# EAGLE design G021 (EAGLE 6.6.0)
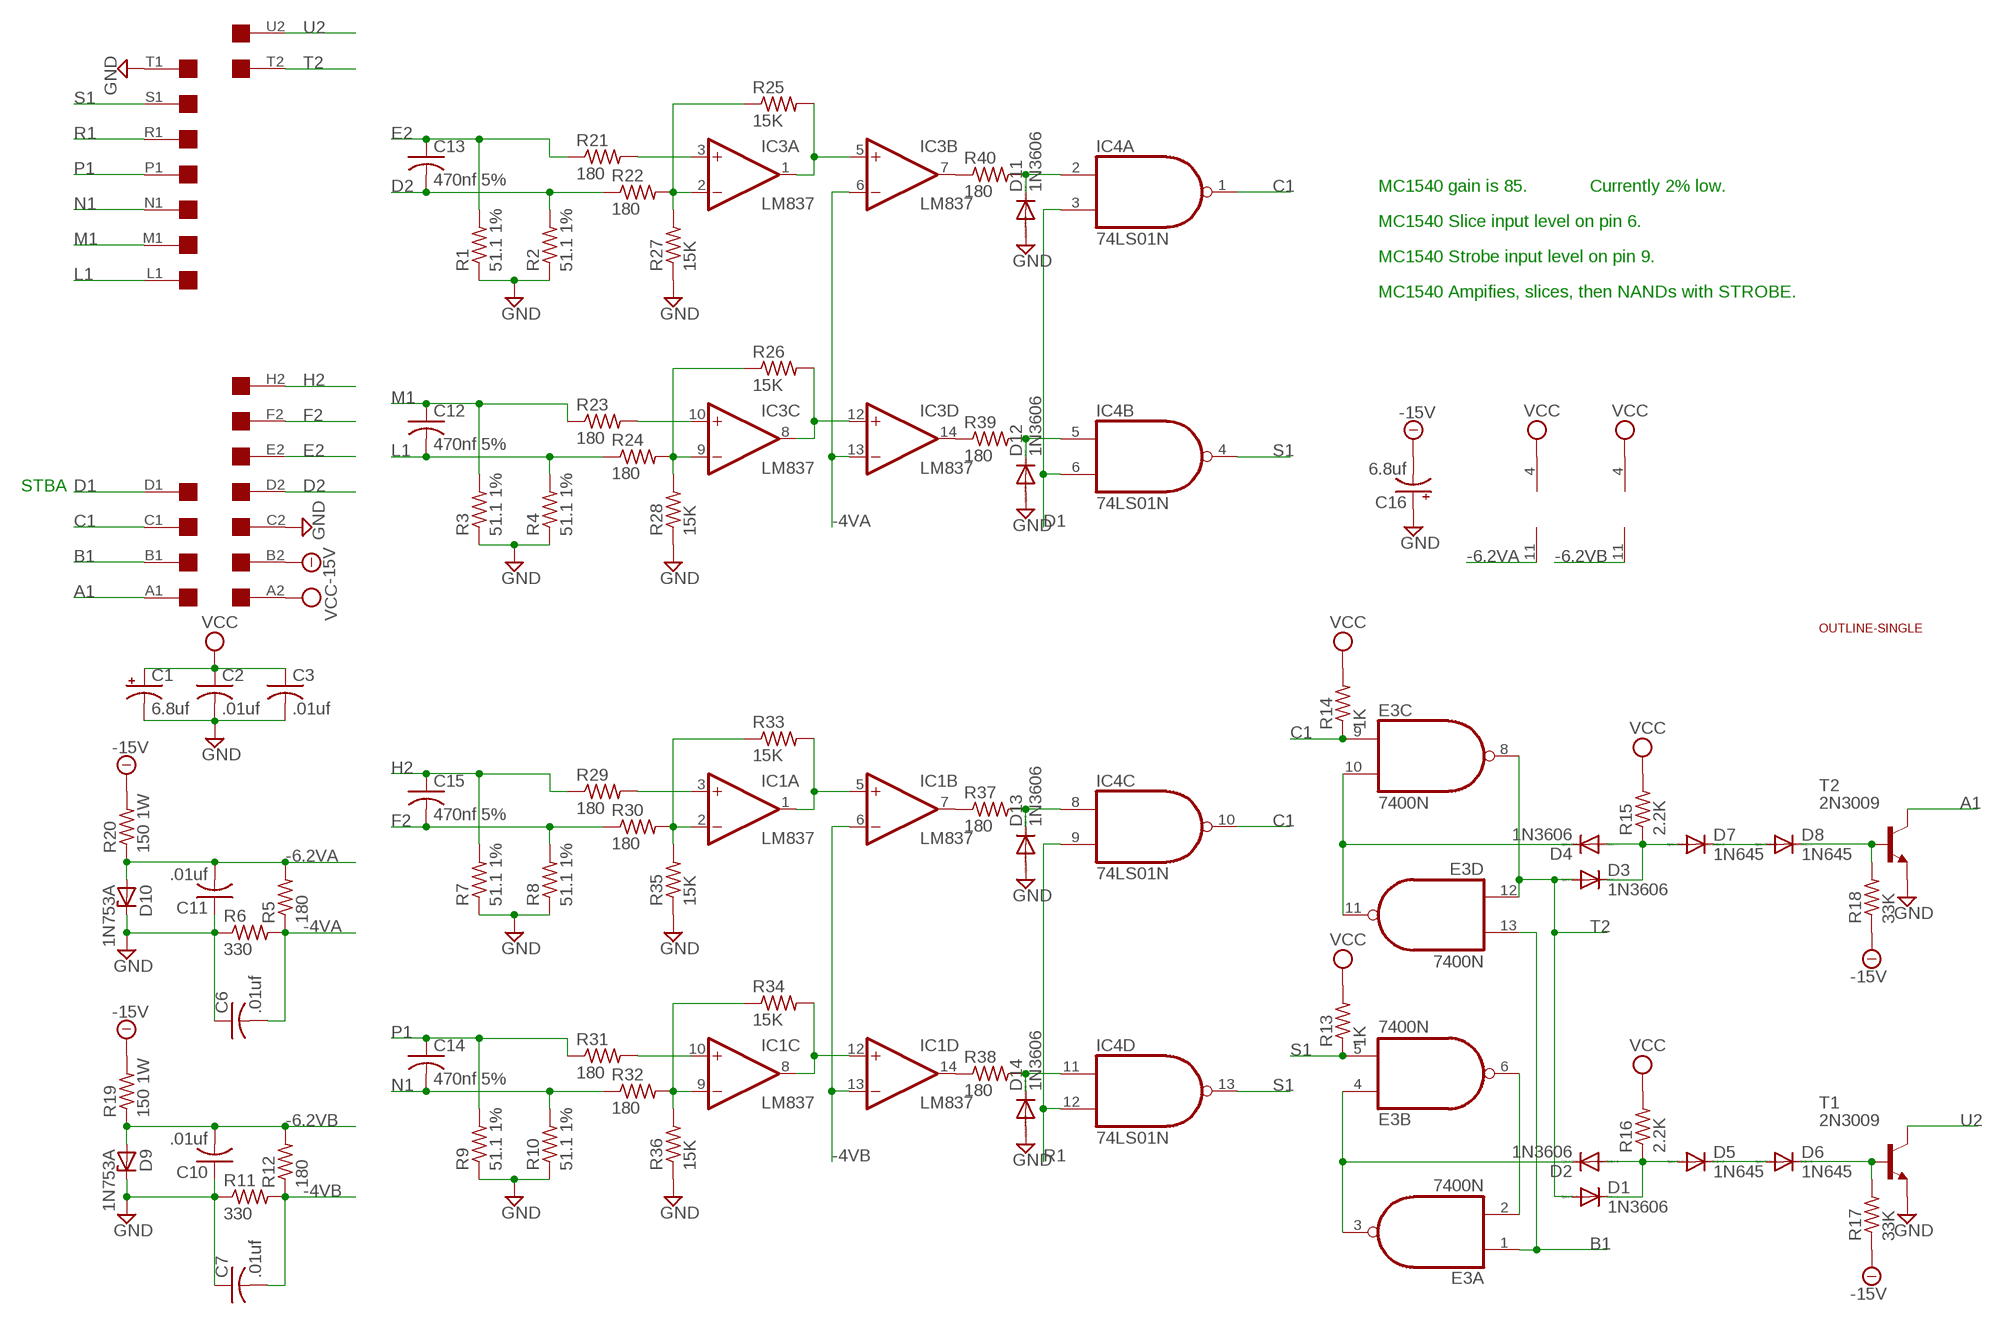
[diagram p0: schematic, sheet 1]

## Parts
C1  6.8uf  CPOL-USE15-5AXIAL  [E15-5]
C2  .01uf  C-US050-025X075  [C050-025X075]
C3  .01uf  C-US050-025X075  [C050-025X075]
C6  .01uf  C-US050-025X075  [C050-025X075]
C7  .01uf  C-US050-025X075  [C050-025X075]
C10  .01uf  C-US050-025X075  [C050-025X075]
C11  .01uf  C-US050-025X075  [C050-025X075]
C12  470nf 5%  C-US050-025X075  [C050-025X075]
C13  470nf 5%  C-US050-025X075  [C050-025X075]
C14  470nf 5%  C-US050-025X075  [C050-025X075]
C15  470nf 5%  C-US050-025X075  [C050-025X075]
C16  6.8uf  CPOL-USE15-5AXIAL  [E15-5]
D1  1N3606  1N4148DO35-10  [DO35-10]
D2  1N3606  1N4148DO35-10  [DO35-10]
D3  1N3606  1N4148DO35-10  [DO35-10]
D4  1N3606  1N4148DO35-10  [DO35-10]
D5  1N645  1N4148DO35-10  [DO35-10]
D6  1N645  1N4148DO35-10  [DO35-10]
D7  1N645  1N4148DO35-10  [DO35-10]
D8  1N645  1N4148DO35-10  [DO35-10]
D9  1N753A  ZENER-DIODEF126-10  [F126Z10]
D10  1N753A  ZENER-DIODEF126-10  [F126Z10]
D11  1N3606  1N4148DO35-10  [DO35-10]
D12  1N3606  1N4148DO35-10  [DO35-10]
D13  1N3606  1N4148DO35-10  [DO35-10]
D14  1N3606  1N4148DO35-10  [DO35-10]
E3  7400N  [DIL14]
IC1  LM837  OP11P  [DIL14]
IC3  LM837  OP11P  [DIL14]
IC4  74LS01N  [DIL14]
R1  51.1 1%  R-US_0207/10  [0207/10]
R2  51.1 1%  R-US_0207/10  [0207/10]
R3  51.1 1%  R-US_0207/10  [0207/10]
R4  51.1 1%  R-US_0207/10  [0207/10]
R5  180  R-US_0207/10  [0207/10]
R6  330  R-US_0207/10  [0207/10]
R7  51.1 1%  R-US_0207/10  [0207/10]
R8  51.1 1%  R-US_0207/10  [0207/10]
R9  51.1 1%  R-US_0207/10  [0207/10]
R10  51.1 1%  R-US_0207/10  [0207/10]
R11  330  R-US_0207/10  [0207/10]
R12  180  R-US_0207/10  [0207/10]
R13  1K  R-US_0207/10  [0207/10]
R14  1K  R-US_0207/10  [0207/10]
R15  2.2K  R-US_0207/10  [0207/10]
R16  2.2K  R-US_0207/10  [0207/10]
R17  33K  R-US_0207/10  [0207/10]
R18  33K  R-US_0207/10  [0207/10]
R19  150 1W  R-US_0414/15  [0414/15]
R20  150 1W  R-US_0414/15  [0414/15]
R21  180  R-US_0207/10  [0207/10]
R22  180  R-US_0207/10  [0207/10]
R23  180  R-US_0207/10  [0207/10]
R24  180  R-US_0207/10  [0207/10]
R25  15K  R-US_0207/10  [0207/10]
R26  15K  R-US_0207/10  [0207/10]
R27  15K  R-US_0207/10  [0207/10]
R28  15K  R-US_0207/10  [0207/10]
R29  180  R-US_0207/10  [0207/10]
R30  180  R-US_0207/10  [0207/10]
R31  180  R-US_0207/10  [0207/10]
R32  180  R-US_0207/10  [0207/10]
R33  15K  R-US_0207/10  [0207/10]
R34  15K  R-US_0207/10  [0207/10]
R35  15K  R-US_0207/10  [0207/10]
R36  15K  R-US_0207/10  [0207/10]
R37  180  R-US_0207/10  [0207/10]
R38  180  R-US_0207/10  [0207/10]
R39  180  R-US_0207/10  [0207/10]
R40  180  R-US_0207/10  [0207/10]
T1  2N3009  2N3565  [TO92]
T2  2N3009  2N3565  [TO92]
U$1  SINGLE  [EDGE-CON2]
U$2  OUTLINE-SINGLE  [SINGLE]

## Nets
-4VA: C6.2 IC3.6(B:-IN) IC3.13(D:-IN) R5.1 R6.2
-4VB: C7.2 IC1.6(B:-IN) IC1.13(D:-IN) R11.2 R12.1
-6.2VA: C11.2 D10.A IC3.11(P:V-) R5.2 R20.1
-6.2VB: C10.2 D9.A IC1.11(P:V-) R12.2 R19.1
-15V: C16.- R17.1 R18.1 R19.2 R20.2 U$1.B2
A1: T2.1(C) U$1.A1
B1: E3.1(A:I0) E3.13(D:I1) U$1.B1
C1: E3.9(C:I0) IC4.1(A:O) IC4.10(C:O) R14.1 U$1.C1
D1: IC4.3(A:I1) IC4.6(B:I1) U$1.D1
D2: C13.2 R2.2 R22.1 U$1.D2
E2: C13.1 R1.2 R21.1 U$1.E2
F2: C15.2 R8.2 R30.1 U$1.F2
GND [supply]: C1.- C2.2 C3.2 C6.1 C7.1 C10.1 C11.1 C16.+ D9.C D10.C D11.A D12.A D13.A D14.A R1.1 R2.1 R3.1 R4.1 R6.1 R7.1 R8.1 R9.1 R10.1 R11.1 R27.1 R28.1 R35.1 R36.1 T1.3(E) T2.3(E) U$1.C2 U$1.T1
H2: C15.1 R7.2 R29.1 U$1.H2
L1: C12.2 R4.2 R24.1 U$1.L1
M1: C12.1 R3.2 R23.1 U$1.M1
N1: C14.2 R10.2 R32.1 U$1.N1
N$1: IC3.7(B:OUT) R40.1
N$2: IC3.14(D:OUT) R39.1
N$3: IC1.7(B:OUT) R37.1
N$4: IC1.14(D:OUT) R38.1
N$5: IC3.8(C:OUT) IC3.12(D:+IN) R26.2
N$6: D1.C D2.A D5.A R16.1
N$7: D4.C E3.10(C:I1) E3.11(D:O)
N$8: D2.C E3.3(A:O) E3.4(B:I0)
N$9: E3.2(A:I1) E3.6(B:O)
N$10: D3.C D4.A D7.A R15.1
N$11: D7.C D8.A
N$12: D5.C D6.A
N$13: D8.C R18.2 T2.2(B)
N$14: D6.C R17.2 T1.2(B)
N$15: IC3.1(A:OUT) IC3.5(B:+IN) R25.2
N$20: IC3.9(C:-IN) R24.2 R26.1 R28.2
N$21: IC3.10(C:+IN) R23.2
N$22: IC3.2(A:-IN) R22.2 R25.1 R27.2
N$23: IC3.3(A:+IN) R21.2
N$24: IC1.8(C:OUT) IC1.12(D:+IN) R34.2
N$25: IC1.1(A:OUT) IC1.5(B:+IN) R33.2
N$30: IC1.9(C:-IN) R32.2 R34.1 R36.2
N$31: IC1.10(C:+IN) R31.2
N$32: IC1.2(A:-IN) R30.2 R33.1 R35.2
N$33: IC1.3(A:+IN) R29.2
N$34: D11.C IC4.2(A:I0) R40.2
N$35: D12.C IC4.5(B:I0) R39.2
N$36: D14.C IC4.11(D:I0) R38.2
N$37: D13.C IC4.8(C:I0) R37.2
P1: C14.1 R9.2 R31.1 U$1.P1
R1: IC4.9(C:I1) IC4.12(D:I1) U$1.R1
S1: E3.5(B:I1) IC4.4(B:O) IC4.13(D:O) R13.1 U$1.S1
T2: D1.A D3.A E3.8(C:O) E3.12(D:I0) U$1.T2
U2: T1.1(C) U$1.U2
VCC [supply]: C1.+ C2.1 C3.1 IC1.4(P:V+) IC3.4(P:V+) R13.2 R14.2 R15.2 R16.2 U$1.A2
Unconnected: U$1.E1 U$1.F1 U$1.H1 U$1.J1 U$1.J2 U$1.K1 U$1.K2 U$1.L2 U$1.M2 U$1.N2 U$1.P2 U$1.R2 U$1.S2 U$1.U1 U$1.V1 U$1.V2

## Notes on the sheet
- MC1540 gain is 85. | Currently 2% low.
- MC1540 Slice input level on pin 6.
- MC1540 Strobe input level on pin 9.
- MC1540 Ampifies, slices, then NANDs with STROBE.
- STBA

## Power pins joined to a net without a drawn wire
GND: E3.7(P:GND) IC4.7(P:GND)
VCC: E3.14(P:VCC) IC4.14(P:VCC)

## Library data of the parts
C1 C16 = rcl:CPOL-US: POLARIZED CAPACITOR, American symbol
C2 C3 C6 C7 C10-C15 = rcl:C-US: CAPACITOR, American symbol
D1-D8 D11-D14 = diode:1N4148: DIODE high speed (Philips)
D9 D10 = diode:ZENER-DIODE: Z-Diode
E3 = 74xx-us:74*00: Quad 2-input NAND gate
IC1 IC3 = linear:OP11: Quad Low-Offset Low-Power OP AMP The OP-11 is pin compatible with the OP-400 , LM148, HA4741, RM4156, and LT1014 operational amplifiers source http://products.analog.com/products/info.asp?product=OP400
IC4 = 74xx-us:74*01: Quad 2-input NAND gate, open collector
R1-R40 = rcl:R-US_: RESISTOR, American symbol
T1 T2 = transistor:2N3565: NPN TRANSISTOR
U$1 = dec-con:SINGLE: Single-Height DEC board
U$2 = dec-con:OUTLINE-*: Board outlines for DEC boards.

## Net classes
1 supply: width 0.762 mm, clearance 0.508 mm

## Board
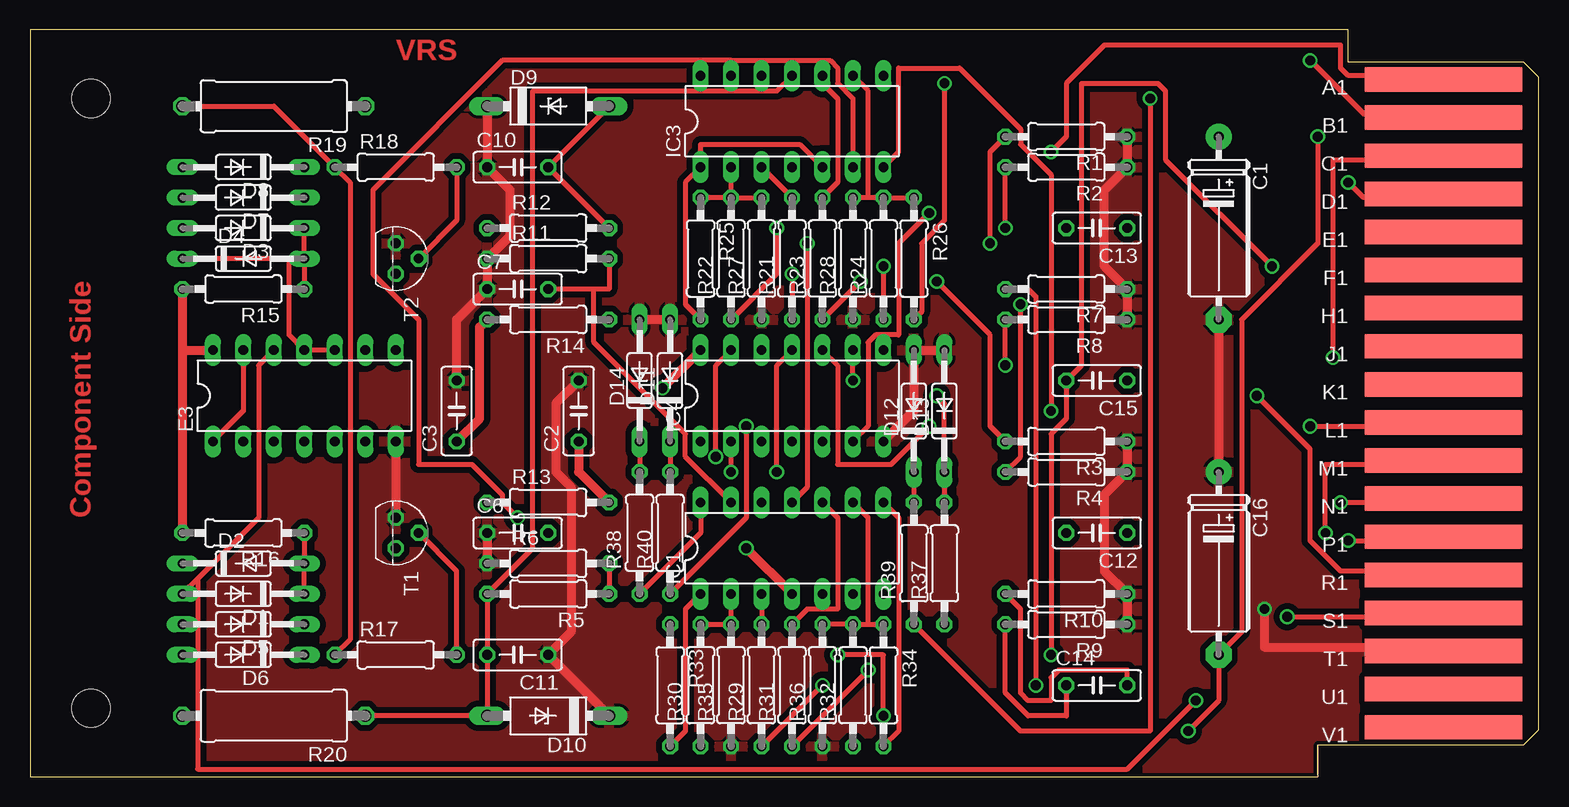
[diagram p1: board, top side]
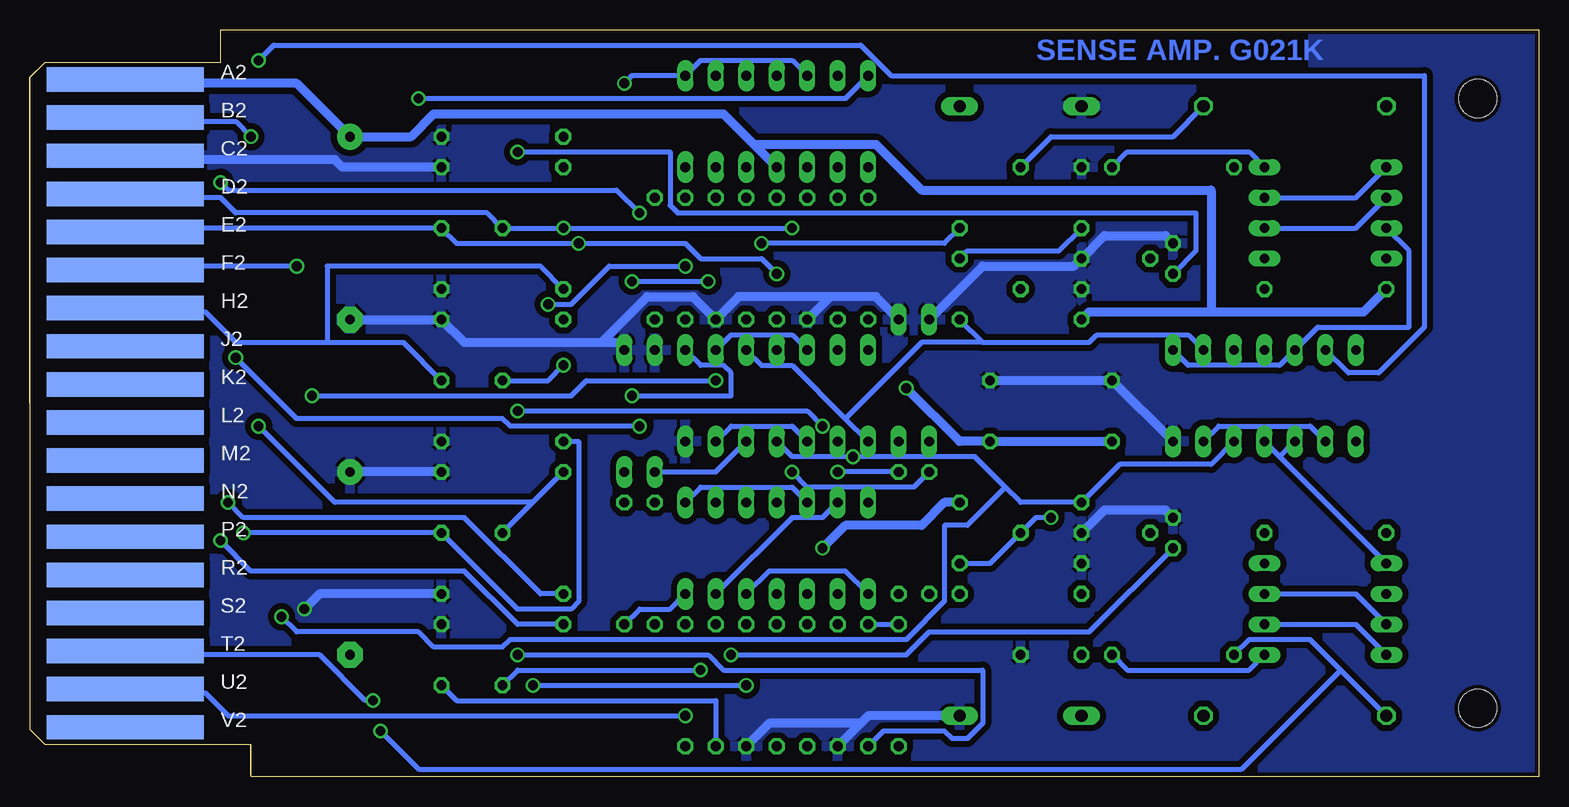
[diagram p2: board, bottom side, seen from below]

Size 125.73 x 62.23 mm. Coordinates in mm from the lower left corner, seen from the top.
Copper layers (1+16): Top 0.035mm / dielectric 1.5mm / Bottom 0.035mm
Design rules "16mils": minimum track width 16mil, minimum drill 32mil, track to track 15mil, track to pad 10mil, pad to pad 10mil, via to via 10mil, smd to smd 10mil, copper to edge 13mil, drill to drill 10mil, minimum pad ring 10mil, minimum via ring 8mil, stop-mask expansion 0mil, vias tented up to drill 0mil, thermal gap 10mil

### Footprints (pad centres in the part's own frame; a part is rotated, then mirrored left to right if it is on the bottom)
E15-5 = drill 0.813 pad 2.159: + -7.62,0 | drill 0.813 pad 2.159 octagon: - 7.62,0
C050-025X075 = drill 0.813 octagon: 1 -2.54,0; 2 2.54,0
DO35-10 = drill 0.813 long: A 5.08,0; C -5.08,0
F126Z10 = drill 1.016 long: A 5.08,0; C -5.08,0
DIL14 = drill 0.813 long: 1 -7.62,-3.81; 2 -5.08,-3.81; 3 -2.54,-3.81; 4 0,-3.81; 5 2.54,-3.81; 6 5.08,-3.81; 7 7.62,-3.81; 8 7.62,3.81; 9 5.08,3.81; 10 2.54,3.81; 11 0,3.81; 12 -2.54,3.81; 13 -5.08,3.81; 14 -7.62,3.81
0207/10 = drill 0.813 octagon: 1 -5.08,0; 2 5.08,0
0414/15 = drill 1.016 octagon: 1 -7.62,0; 2 7.62,0
TO92 = drill 0.813 octagon: 1 1.27,0; 2 0,1.905; 3 -1.27,0
EDGE-CON2 = smd 13.106 x 2.032: A1 7.938,4.128; B1 7.938,7.303; C1 7.938,10.477; D1 7.938,13.652; E1 7.938,16.828; F1 7.938,20.003; H1 7.938,23.177; J1 7.938,26.352; K1 7.938,29.527; L1 7.938,32.703; M1 7.938,35.877; N1 7.938,39.053; P1 7.938,42.227; R1 7.938,45.403; S1 7.938,48.578; T1 7.938,51.752; U1 7.938,54.928; V1 7.938,58.102 | smd 13.106 x 2.032 bottom: A2 7.938,4.128; B2 7.938,7.303; C2 7.938,10.477; D2 7.938,13.652; E2 7.938,16.828; F2 7.938,20.003; H2 7.938,23.177; J2 7.938,26.352; K2 7.938,29.527; L2 7.938,32.703; M2 7.938,35.877; N2 7.938,39.053; P2 7.938,42.227; R2 7.938,45.403; S2 7.938,48.578; T2 7.938,51.752; U2 7.938,54.928; V2 7.938,58.102
SINGLE = hole 3.175: 120.65,56.515; 120.65,5.715

### Placement (x,y rotation side)
C1  99.06,45.72 270 top
C2  45.72,30.48 90 top
C3  35.56,30.48 90 top
C6  40.64,20.32 0 top
C7  40.64,40.64 0 top
C10  40.64,50.8 0 top
C11  40.64,10.16 180 top
C12  88.9,20.32 180 top
C13  88.9,45.72 180 top
C14  88.9,7.62 0 top
C15  88.9,33.02 180 top
C16  99.06,17.78 270 top
D1  17.78,15.24 180 top
D2  17.78,17.78 0 top
D3  17.78,45.72 180 top
D4  17.78,43.18 0 top
D5  17.78,12.7 180 top
D6  17.78,10.16 180 top
D7  17.78,48.26 180 top
D8  17.78,50.8 180 top
D9  43.18,55.88 0 top
D10  43.18,5.08 180 top
D11  53.34,33.02 90 top
D12  73.66,30.48 90 top
D13  76.2,30.48 90 top
D14  50.8,33.02 90 top
E3  22.86,31.75 0 top
IC1  63.5,19.05 0 top
IC3  63.5,54.61 0 top
IC4  63.5,31.75 0 top
R1  86.36,53.34 180 top
R2  86.36,50.8 180 top
R3  86.36,27.94 180 top
R4  86.36,25.4 180 top
R5  43.18,15.24 180 top
R6  43.18,17.78 0 top
R7  86.36,40.64 180 top
R8  86.36,38.1 180 top
R9  86.36,12.7 180 top
R10  86.36,15.24 180 top
R11  43.18,43.18 0 top
R12  43.18,45.72 0 top
R13  43.18,22.86 0 top
R14  43.18,38.1 180 top
R15  17.78,40.64 180 top
R16  17.78,20.32 180 top
R17  30.48,10.16 0 top
R18  30.48,50.8 0 top
R19  20.32,55.88 180 top
R20  20.32,5.08 180 top
R21  63.5,43.18 90 top
R22  58.42,43.18 90 top
R23  66.04,43.18 90 top
R24  71.12,43.18 90 top
R25  55.88,43.18 270 top
R26  73.66,43.18 270 top
R27  60.96,43.18 90 top
R28  68.58,43.18 90 top
R29  60.96,7.62 90 top
R30  55.88,7.62 90 top
R31  63.5,7.62 90 top
R32  68.58,7.62 90 top
R33  53.34,7.62 270 top
R34  71.12,7.62 270 top
R35  58.42,7.62 90 top
R36  66.04,7.62 90 top
R37  76.2,17.78 90 top
R38  50.8,20.32 90 top
R39  73.66,17.78 90 top
R40  53.34,20.32 90 top
T1  30.48,20.32 270 top
T2  30.48,43.18 270 top
U$1  125.73,62.23 180 top
U$2  125.73,62.23 180 top

### Tracks (layer width: path | path; a pad name or v marks a point on that pad's centre or on a via)
-4VA  (via drill 0.81)
  Top 0.406: R6.2 R5.1 | IC3.6 68.58,56.52 67.31,57.78 67.31,59.05 66.67,59.69 58.42,59.69 | IC3.13 58.42,59.69 | v40.64,21.59 39.37,22.86 39.37,23.5 36.83,26.04 32.38,26.04 32.38,38.1 28.57,41.91 28.57,48.9 39.37,59.69 58.42,59.69
  Bottom 0.406: R6.2 45.72,17.78 C6.2 41.91,21.59 v40.64,21.59
-4VB
  Top 0.406: 46.99,40.64 48.26,40.64 R11.2 | 46.99,40.64 C7.2 | 46.99,40.64 46.99,36.2 54.61,28.57 54.61,26.67 IC1.13
  Bottom 0.406: R12.1 40.01,43.81 47.62,43.81 R11.2 | IC1.6 62.23,21.59 59.69,21.59 IC1.13
-6.2VA
  Top 0.406: R20.1 D10.A C11.2 R5.2 41.91,19.05 41.91,57.15 62.23,57.15 IC3.11
-6.2VB  (via drill 0.81)
  Top 0.406: D9.A C10.2 R12.2 | IC1.11 64.77,24.13 v64.77,44.45
  Bottom 0.406: R19.1 30.48,53.34 40.64,53.34 C10.2 | v64.77,44.45 49.53,44.45 R12.2
-15V  (via drill 0.81)
  Top 0.406: R19.2 20.32,55.88 R18.1 26.67,49.53 26.67,11.43 R17.1 | v107.31,53.34 107.31,44.45 100.97,38.1 100.97,12.06 C16.- 99.06,6.35 v96.52,3.81
  Bottom 0.406: R17.1 24.13,11.43 19.05,11.43 16.51,8.89 | R20.2 16.51,8.89 | v107.31,53.34 108.58,54.61 117.47,54.61 U$1.B2 | 16.51,8.89 24.77,0.64 93.34,0.64 v96.52,3.81
A1  (via drill 0.81)
  Top 0.406: v85.09,52.07 86.36,53.34 86.36,57.78 89.53,60.96 109.22,60.96 109.22,59.05 109.86,58.42 117.47,58.42 U$1.A1
  Bottom 0.406: T2.1 28.57,43.81 28.57,46.99 71.75,46.99 72.39,47.62 72.39,52.07 v85.09,52.07
B1  (via drill 0.81)
  Top 0.406: E3.1 17.78,30.48 E3.13 | v106.68,59.69 111.12,55.24 117.47,55.24 U$1.B1
  Bottom 0.406: E3.13 15.88,33.66 13.34,33.66 9.53,37.47 9.53,58.42 53.98,58.42 56.52,60.96 105.41,60.96 v106.68,59.69
C1  (via drill 0.81)
  Top 0.406: v108.58,34.92 108.58,51.44 117.47,51.44 U$1.C1 | v74.93,29.21 71.75,26.04 67.31,26.04 67.31,34.29 IC4.10
  Bottom 0.406: 57.78,29.84 62.23,34.29 64.77,34.29 IC4.10 | 57.78,29.84 IC4.1 | E3.9 29.21,36.83 36.83,36.83 37.47,36.2 46.35,36.2 | R14.1 46.35,36.2 | 57.78,29.84 51.44,36.2 46.35,36.2 | v108.58,34.92 103.5,29.84 86.36,29.84 85.72,29.21 v74.93,29.21
D1  (via drill 0.81)
  Top 0.406: IC4.6 69.85,29.21 69.85,36.2 70.48,36.83 72.39,36.83 72.39,44.45 v74.93,46.99 | v109.86,49.53 111.12,48.26 117.47,48.26 U$1.D1
  Bottom 0.406: IC4.3 62.23,29.21 67.31,29.21 IC4.6 | v74.93,46.99 76.83,48.9 109.22,48.9 v109.86,49.53
D2  (via drill 0.81)
  Top 0.406: R22.1 62.23,41.91 v62.23,45.72 | v81.28,45.72 R2.2
  Bottom 0.406: v62.23,45.72 v81.28,45.72 C13.2 87.63,46.99 108.58,46.99 109.86,48.26 117.47,48.26 U$1.D2
E2  (via drill 0.81)
  Top 0.406: v63.5,41.91 R21.1 | R1.2 80.01,52.07 v80.01,44.45
  Bottom 0.406: v63.5,41.91 64.77,43.18 69.85,43.18 71.12,44.45 v80.01,44.45 90.17,44.45 C13.1 117.47,45.72 U$1.E2
F2  (via drill 0.81)
  Top 0.406: v85.09,10.16 85.09,28.57 86.36,29.84 C15.2 87.63,34.29 87.63,57.78 93.98,57.78 94.61,57.15 94.61,51.44 v103.5,42.55 | v81.28,34.29 R8.2
  Bottom 0.406: R30.1 54.61,3.81 49.53,3.81 48.9,3.17 47.62,3.17 46.35,4.45 46.35,8.89 67.94,8.89 69.22,10.16 v85.09,10.16 | v81.28,34.29 82.55,33.02 C15.2 | v103.5,42.55 117.47,42.55 U$1.F2
GND  (via drill 0.81)
  Top 0.762: D10.C C11.1 45.09,12.06 45.09,24.13 43.81,25.4 43.81,31.11 C2.2 | D9.C C10.1 40.01,48.9 40.01,45.09 R11.1 C7.1 35.56,38.1 C3.2 | C6.1 R6.1 | E3.7 T1.3 | R9.1 R10.1 89.53,17.14 89.53,23.5 R4.1 R3.1 | D11.A D14.A | IC4.7 73.66,30.48 D12.A D13.A | R1.1 R2.1 89.53,48.9 89.53,42.55 R7.1 R8.1 | C1.- C16.+ | v102.87,13.97 102.87,10.79 117.47,10.79 U$1.T1
  Bottom 0.762: 56.52,4.45 55.88,5.08 D10.C | 56.52,4.45 R35.1 | R36.1 64.14,4.45 56.52,4.45 | T2.3 31.11,45.09 36.2,45.09 R11.1 38.73,42.55 46.35,42.55 D14.A | E3.7 C3.2 C2.2 | C6.1 36.2,22.23 31.11,22.23 T1.3 | R4.1 C16.+ | 59.05,40.01 R27.1 | 59.05,40.01 55.24,40.01 D11.A | 59.05,40.01 66.67,40.01 R28.1 70.48,40.01 74.3,40.01 78.11,36.2 | C1.- R8.1 89.53,36.2 78.11,36.2 | D13.A 76.83,36.2 78.11,36.2 | v102.87,13.97 101.6,15.24 R10.1 | R2.1 99.69,50.8 100.33,51.44 117.47,51.44 U$1.C2
  pour Bottom (isolate 0.254): 0,62.23 111.76,62.23 111.76,0 0,0
  pour Top (isolate 0.254): 0,62.23 111.76,62.23 111.76,0 0,0
H2  (via drill 0.81)
  Top 0.406: v66.04,7.62 R29.1 | v83.82,7.62 83.82,40.01 83.19,40.64 R7.2
  Bottom 0.406: C15.1 94.61,36.2 100.97,36.2 | 100.97,36.2 108.58,36.2 111.12,38.73 117.47,38.73 U$1.H2 | v83.82,7.62 v66.04,7.62 | 100.97,36.2 100.97,42.55 83.19,42.55 R7.2
L1  (via drill 0.81)
  Top 0.406: v71.12,42.55 R24.1 | v82.55,39.37 82.55,26.67 R4.2 | v106.68,29.21 117.47,29.21 U$1.L1
  Bottom 0.406: C12.2 83.82,22.86 | 83.82,22.86 R4.2 | v71.12,42.55 77.47,42.55 80.64,39.37 v82.55,39.37 | v106.68,29.21 100.33,22.86 83.82,22.86
M1  (via drill 0.81)
  Top 0.406: v69.22,41.27 R23.1 | v75.56,41.27 80.01,36.83 80.01,29.21 R3.2 | v107.95,20.32 107.95,26.04 117.47,26.04 U$1.M1
  Bottom 0.406: v75.56,41.27 v69.22,41.27 | R3.2 80.01,27.94 80.01,14.61 80.64,13.97 85.09,13.97 C12.1 v107.95,20.32
N1  (via drill 0.81)
  Top 0.406: R10.2 82.55,13.97 82.55,6.99 83.19,6.35 85.09,6.35 85.09,8.26 85.72,8.89 91.44,8.89 C14.2 | v109.22,22.86 117.47,22.86 U$1.N1
  Bottom 0.406: R32.1 68.58,6.35 90.17,6.35 C14.2 | v109.22,22.86 107.95,21.59 89.53,21.59 83.19,15.24 R10.2
N$1  (via drill 0.81)
  Top 0.406: R40.1 59.69,21.59 v59.69,29.21 | v85.09,30.48 85.09,50.16 82.55,52.7 82.55,53.98 77.47,59.05 72.39,59.05 72.39,52.07 IC3.7
  Bottom 0.406: v59.69,29.21 60.96,30.48 v85.09,30.48
N$2  (via drill 0.81)
  Top 0.406: R39.1 82.55,3.81 93.34,3.81 v93.34,56.52
  Bottom 0.406: v93.34,56.52 57.78,56.52 IC3.14
N$3
  Bottom 0.406: IC1.7 72.39,13.97 74.93,13.97 R37.1
N$4
  Top 0.406: R38.1 55.88,20.32 IC1.14
N$5  (via drill 0.81)
  Top 0.406: R26.2 74.3,38.73 74.3,44.45 76.2,46.35 v76.2,57.78
  Bottom 0.406: IC3.12 62.23,59.69 69.85,59.69 IC3.8 75.56,58.42 v76.2,57.78
N$6
  Top 0.406: R16.1 D2.A D1.C
  Bottom 0.406: D5.A 15.24,15.24 D1.C
N$7
  Top 0.406: E3.10 E3.11 21.59,36.83 21.59,43.18 D4.C
N$8
  Bottom 0.406: E3.4 21.59,26.67 | 21.59,26.67 D2.C | 21.59,26.67 E3.3
N$9
  Bottom 0.406: E3.2 19.05,29.21 26.67,29.21 E3.6
N$10
  Top 0.406: R15.1 D4.A D3.C
  Bottom 0.406: D7.A 15.24,45.72 D3.C
N$11
  Bottom 0.406: D8.A 15.24,48.26 D7.C
N$12
  Bottom 0.406: D6.A 15.24,12.7 D5.C
N$13
  Top 0.406: T2.2 35.56,46.35 R18.2
  Bottom 0.406: D8.C 24.13,52.07 34.29,52.07 R18.2
N$14
  Top 0.406: T1.2 35.56,17.14 R17.2
  Bottom 0.406: D6.C 24.13,8.89 34.29,8.89 R17.2
N$15
  Top 0.406: R25.2 54.61,39.37 54.61,49.53 IC3.1 55.88,52.7 64.14,52.7 IC3.5
N$20
  Top 0.406: 69.85,48.26 R24.2 R26.1 | 69.85,48.26 R28.2 | IC3.9 69.85,57.15 69.85,48.26
N$21
  Top 0.406: R23.2 67.31,49.53 67.31,56.52 66.04,57.78 IC3.10
N$22
  Top 0.406: R22.2 R25.1 | R22.2 R27.2 | R22.2 IC3.2
N$23
  Top 0.406: R21.2 IC3.3
N$24
  Top 0.406: R34.2 72.39,3.81 72.39,21.59 IC1.8
  Bottom 0.406: IC1.12 62.23,24.13 69.85,24.13 IC1.8
N$25
  Top 0.406: R33.2 54.61,3.81 54.61,13.97 IC1.1
  Bottom 0.406: IC1.5 64.14,17.14 57.78,17.14 IC1.1
N$30
  Top 0.406: R36.2 R32.2 69.85,12.7 | 69.85,12.7 R34.1 | IC1.9 69.85,21.59 69.85,12.7
N$31
  Top 0.406: R31.2 64.77,13.97 67.31,13.97 67.31,21.59 IC1.10
N$32
  Top 0.406: R30.2 R35.2 IC1.2
  Bottom 0.406: R30.2 R33.1
N$33
  Top 0.406: IC1.3 R29.2
N$34  (via drill 0.81)
  Top 0.406: D11.C R40.2 | v58.42,25.4 IC4.2
  Bottom 0.406: R40.2 v58.42,25.4
N$35
  Top 0.406: D12.C R39.2
  Bottom 0.406: IC4.5 68.58,25.4 D12.C
N$36  (via drill 0.81)
  Top 0.406: D14.C R38.2 | IC4.11 62.23,34.29 v62.23,25.4
  Bottom 0.406: v62.23,25.4 60.96,24.13 52.07,24.13 R38.2
N$37  (via drill 0.81)
  Top 0.406: R37.2 D13.C 76.2,31.11 v75.56,31.75
  Bottom 0.406: IC4.8 69.85,34.29 67.94,34.29 67.31,33.66 67.31,31.75 v75.56,31.75
P1  (via drill 0.81)
  Top 0.406: v69.85,8.89 R31.1 | R9.2 81.28,6.99 83.19,5.08 86.36,5.08 C14.1 | v109.86,19.68 117.47,19.68 U$1.P1
  Bottom 0.406: v69.85,8.89 85.09,8.89 C14.1 | v109.86,19.68 107.31,17.14 89.53,17.14 85.09,12.7 R9.2
R1  (via drill 0.81)
  Top 0.406: v68.58,33.02 IC4.9 | v102.23,31.75 106.68,27.3 106.68,19.68 109.22,17.14 117.47,17.14 U$1.R1
  Bottom 0.406: IC4.12 62.23,36.83 67.31,36.83 IC4.9 | v68.58,33.02 79.38,33.02 80.64,31.75 v102.23,31.75
S1  (via drill 0.81)
  Top 0.406: IC4.13 57.15,34.29 v57.15,26.67 | v104.78,13.34 117.47,13.34 U$1.S1
  Bottom 0.406: E3.5 27.3,26.04 34.92,26.04 R13.1 43.18,22.86 44.45,24.13 | IC4.4 62.23,26.67 v57.15,26.67 46.99,26.67 44.45,24.13 | v104.78,13.34 103.5,12.06 93.34,12.06 92.08,10.79 86.36,10.79 85.72,11.43 52.7,11.43 49.53,14.61 49.53,20.95 47.62,20.95 44.45,24.13
T2  (via drill 0.81)
  Top 0.406: 13.97,16.51 19.05,21.59 19.05,34.29 E3.12 | 13.97,16.51 D1.A | v97.16,6.35 91.44,0.64 13.97,0.64 13.97,16.51
  Bottom 0.406: E3.8 29.21,34.29 21.59,34.29 E3.12 18.41,37.47 10.79,37.47 10.79,43.81 D3.A | v97.16,6.35 97.79,6.35 101.6,10.16 117.47,10.16 U$1.T2
U2  (via drill 0.81)
  Top 0.406: v67.31,10.16 71.12,10.16 v71.12,5.08
  Bottom 0.406: T1.1 37.47,12.06 50.8,12.06 52.7,10.16 v67.31,10.16 | v71.12,5.08 109.22,5.08 111.12,6.99 117.47,6.99 U$1.U2
VCC  (via drill 0.81)
  Top 0.762: R15.2 12.7,35.56 | 12.7,35.56 R16.2 | 12.7,35.56 E3.14 | R13.2 45.72,25.4 C2.1 | R14.2 37.47,37.47 37.47,29.84 C3.1 | v59.69,19.05 IC1.4 | v52.7,32.38 IC4.14
  Bottom 0.762: C3.1 C2.1 48.26,27.94 v52.7,32.38 | v59.69,19.05 57.78,20.95 51.44,20.95 49.53,22.86 R13.2 | R15.2 14.61,38.73 27.3,38.73 | 27.3,38.73 37.47,38.73 R14.2 | 65.41,52.7 67.94,55.24 92.08,55.24 93.98,53.34 C1.+ 103.5,57.78 117.47,57.78 U$1.A2 | 65.41,52.7 IC3.4 | 27.3,38.73 27.3,48.9 51.44,48.9 55.24,52.7 65.41,52.7

### Text on the board
Top: VRS | Component Side
Bottom: SENSE AMP. G021K